# EAGLE design OpenAGBoardPart1 (EAGLE 7.5.0)
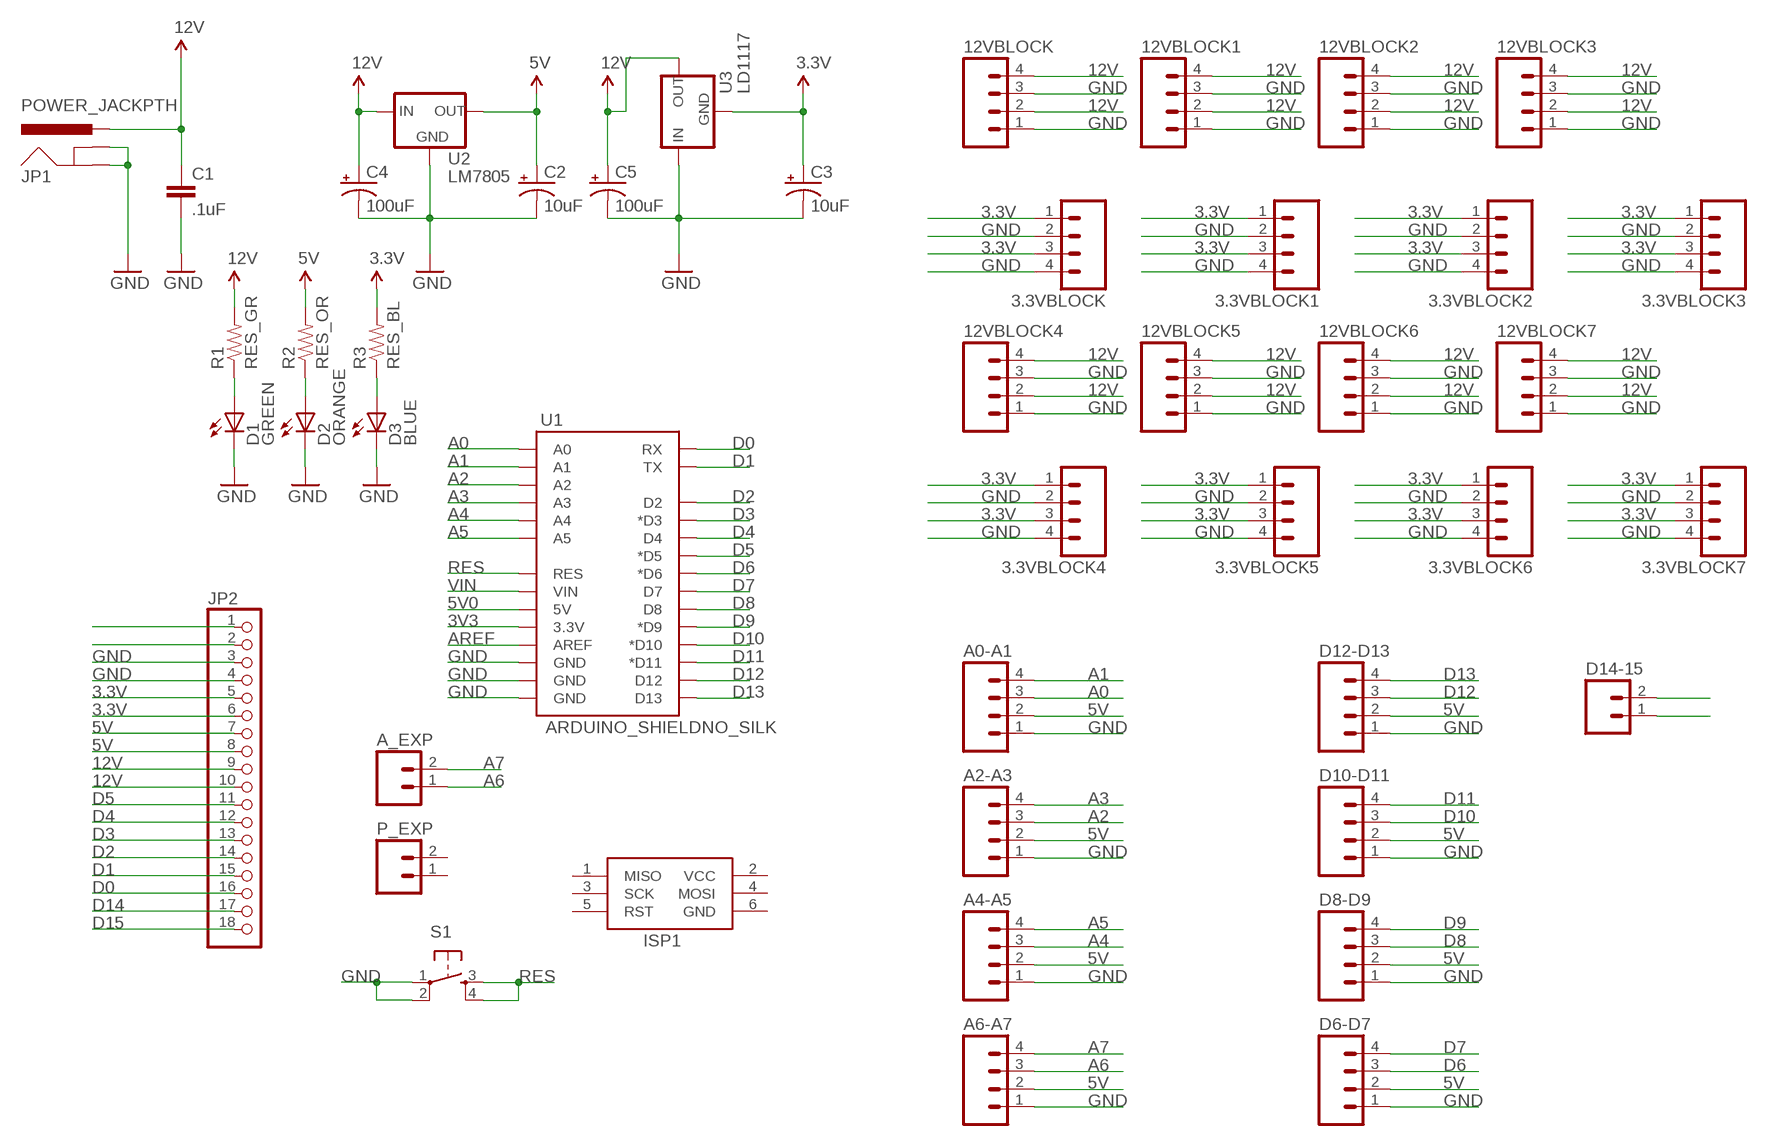
[diagram p0: schematic, sheet 1]

## Parts
3.3VBLOCK  M04NO_SILK_ALL_ROUND  [1X04_NO_SILK_ALL_ROUND]
3.3VBLOCK1  M04NO_SILK_ALL_ROUND  [1X04_NO_SILK_ALL_ROUND]
3.3VBLOCK2  M04NO_SILK_ALL_ROUND  [1X04_NO_SILK_ALL_ROUND]
3.3VBLOCK3  M04NO_SILK_ALL_ROUND  [1X04_NO_SILK_ALL_ROUND]
3.3VBLOCK4  M04NO_SILK_ALL_ROUND  [1X04_NO_SILK_ALL_ROUND]
3.3VBLOCK5  M04NO_SILK_ALL_ROUND  [1X04_NO_SILK_ALL_ROUND]
3.3VBLOCK6  M04NO_SILK_ALL_ROUND  [1X04_NO_SILK_ALL_ROUND]
3.3VBLOCK7  M04NO_SILK_ALL_ROUND  [1X04_NO_SILK_ALL_ROUND]
12VBLOCK  M04NO_SILK_ALL_ROUND  [1X04_NO_SILK_ALL_ROUND]
12VBLOCK1  M04NO_SILK_ALL_ROUND  [1X04_NO_SILK_ALL_ROUND]
12VBLOCK2  M04NO_SILK_ALL_ROUND  [1X04_NO_SILK_ALL_ROUND]
12VBLOCK3  M04NO_SILK_ALL_ROUND  [1X04_NO_SILK_ALL_ROUND]
12VBLOCK4  M04NO_SILK_ALL_ROUND  [1X04_NO_SILK_ALL_ROUND]
12VBLOCK5  M04NO_SILK_ALL_ROUND  [1X04_NO_SILK_ALL_ROUND]
12VBLOCK6  M04NO_SILK_ALL_ROUND  [1X04_NO_SILK_ALL_ROUND]
12VBLOCK7  M04NO_SILK_ALL_ROUND  [1X04_NO_SILK_ALL_ROUND]
A0-A1  M04NO_SILK_ALL_ROUND  [1X04_NO_SILK_ALL_ROUND]
A2-A3  M04NO_SILK_ALL_ROUND  [1X04_NO_SILK_ALL_ROUND]
A4-A5  M04NO_SILK_ALL_ROUND  [1X04_NO_SILK_ALL_ROUND]
A6-A7  M04NO_SILK_ALL_ROUND  [1X04_NO_SILK_ALL_ROUND]
A_EXP  M02PTH  [1X02]
C1  .1uF  CAPPTH  [CAP-PTH-SMALL]
C2  10uF  CAP_POLPTH2  [CPOL-RADIAL-10UF-25V]
C3  10uF  CAP_POLPTH2  [CPOL-RADIAL-10UF-25V]
C4  100uF  CAP_POLPTH1  [CPOL-RADIAL-100UF-25V]
C5  100uF  CAP_POLPTH1  [CPOL-RADIAL-100UF-25V]
D1  GREEN  LED5MM  [LED5MM]
D2  ORANGE  LED5MM  [LED5MM]
D3  BLUE  LED5MM  [LED5MM]
D6-D7  M04NO_SILK_ALL_ROUND  [1X04_NO_SILK_ALL_ROUND]
D8-D9  M04NO_SILK_ALL_ROUND  [1X04_NO_SILK_ALL_ROUND]
D10-D11  M04NO_SILK_ALL_ROUND  [1X04_NO_SILK_ALL_ROUND]
D12-D13  M04NO_SILK_ALL_ROUND  [1X04_NO_SILK_ALL_ROUND]
D14-15  M02PTH  [1X02]
ISP1  AVRISP-6  [AVRISP]
JP1  POWER_JACKPTH  [POWER_JACK_PTH]
JP2  PINHD-1X18-BIG  [1X18-BIG]
P_EXP  M02PTH  [1X02]
R1  RES_GR  RESISTORPTH-1/4W  [AXIAL-0.4]
R2  RES_OR  RESISTORPTH-1/4W  [AXIAL-0.4]
R3  RES_BL  RESISTORPTH-1/4W  [AXIAL-0.4]
S1  TAC_SWITCHPTH  [TACTILE-PTH]
U1  ARDUINO_SHIELDNO_SILK  [DUEMILANOVE_VIAS]
U2  LM7805  V_REG_78XXSINK  [TO220-IGO]
U3  LD1117  V_REG_78XXSINK  [TO220-IGO]

## Nets
3.3V: 3.3VBLOCK1.1 3.3VBLOCK1.3 3.3VBLOCK2.1 3.3VBLOCK2.3 3.3VBLOCK3.1 3.3VBLOCK3.3 3.3VBLOCK4.1 3.3VBLOCK4.3 3.3VBLOCK5.1 3.3VBLOCK5.3 3.3VBLOCK6.1 3.3VBLOCK6.3 3.3VBLOCK7.1 3.3VBLOCK7.3 3.3VBLOCK.1 3.3VBLOCK.3 C3.1(+) JP2.5 JP2.6 R3.P$2 U3.GND
3V3: U1.3.3V
5V: A0-A1.2 A2-A3.2 A4-A5.2 A6-A7.2 C2.1(+) D6-D7.2 D8-D9.2 D10-D11.2 D12-D13.2 JP2.7 JP2.8 R2.P$2 U2.OUT
5V0: U1.5V
12V: 12VBLOCK1.2 12VBLOCK1.4 12VBLOCK2.2 12VBLOCK2.4 12VBLOCK3.2 12VBLOCK3.4 12VBLOCK4.2 12VBLOCK4.4 12VBLOCK5.2 12VBLOCK5.4 12VBLOCK6.2 12VBLOCK6.4 12VBLOCK7.2 12VBLOCK7.4 12VBLOCK.2 12VBLOCK.4 C1.1 C4.1(+) C5.1(+) JP1.PWR JP2.9 JP2.10 R1.P$2 U2.IN U3.OUT
A0: A0-A1.3 U1.A0
A1: A0-A1.4 U1.A1
A2: A2-A3.3 U1.A2
A3: A2-A3.4 U1.A3
A4: A4-A5.3 U1.A4
A5: A4-A5.4 U1.A5
A6: A6-A7.3 A_EXP.1
A7: A6-A7.4 A_EXP.2
AREF: U1.AREF
CONTINUITY_STRIP: JP2.1
D0: JP2.16 U1.RX
D1: JP2.15 U1.TX
D2: JP2.14 U1.D2
D3: JP2.13 U1.D3(*D3)
D4: JP2.12 U1.D4
D5: JP2.11 U1.D5(*D5)
D6: D6-D7.3 U1.D6(*D6)
D7: D6-D7.4 U1.D7
D8: D8-D9.3 U1.D8
D9: D8-D9.4 U1.D9(*D9)
D10: D10-D11.3 U1.D10(*D10)
D11: D10-D11.4 U1.D11(*D11)
D12: D12-D13.3 U1.D12
D13: D12-D13.4 U1.D13
D14: D14-15.1 JP2.17
D15: D14-15.2 JP2.18
GND: 3.3VBLOCK1.2 3.3VBLOCK1.4 3.3VBLOCK2.2 3.3VBLOCK2.4 3.3VBLOCK3.2 3.3VBLOCK3.4 3.3VBLOCK4.2 3.3VBLOCK4.4 3.3VBLOCK5.2 3.3VBLOCK5.4 3.3VBLOCK6.2 3.3VBLOCK6.4 3.3VBLOCK7.2 3.3VBLOCK7.4 3.3VBLOCK.2 3.3VBLOCK.4 12VBLOCK1.1 12VBLOCK1.3 12VBLOCK2.1 12VBLOCK2.3 12VBLOCK3.1 12VBLOCK3.3 12VBLOCK4.1 12VBLOCK4.3 12VBLOCK5.1 12VBLOCK5.3 12VBLOCK6.1 12VBLOCK6.3 12VBLOCK7.1 12VBLOCK7.3 12VBLOCK.1 12VBLOCK.3 A0-A1.1 A2-A3.1 A4-A5.1 A6-A7.1 C1.2 C2.2(-) C3.2(-) C4.2(-) C5.2(-) D1.K(C) D2.K(C) D3.K(C) D6-D7.1 D8-D9.1 D10-D11.1 D12-D13.1 JP1.GND JP1.GNDBREAK JP2.3 JP2.4 S1.1 S1.2 U1.GND@0(GND) U1.GND@1(GND) U1.GND@2(GND) U2.GND U3.IN
N$1: D1.A R1.P$1
N$2: D2.A R2.P$1
N$3: D3.A R3.P$1
N$5: JP2.2
RES: S1.3 S1.4 U1.RES
VIN: U1.VIN
Unconnected: ISP1.1(MISO) ISP1.3(SCK) ISP1.4(MOSI) ISP1.5(RST) P_EXP.1 P_EXP.2

## Power pins joined to a net without a drawn wire
GND: ISP1.6(GND)
VCC: ISP1.2(VCC)

## Library data of the parts
3.3VBLOCK 3.3VBLOCK1-3.3VBLOCK7 12VBLOCK 12VBLOCK1-12VBLOCK7 A0-A1 A2-A3 A4-A5 A6-A7 D6-D7 D8-D9 D10-D11 D12-D13 = SparkFun-Connectors:M04: Header 4 Standard 4-pin 0.1" header. Use with straight break away headers (SKU : PRT-00116), right angle break away headers (PRT-00553), swiss pins (PRT-00743), machine pins (PRT-00117), and female headers (PRT-00115). Molex polarized connector foot print use with SKU : PRT-08231 with associated crimp pins and housings. 1MM SMD Version SKU: PRT-10208
A_EXP D14-15 P_EXP = SparkFun-Connectors:M02: Standard 2-pin 0.1" header. Use with - straight break away headers ( PRT-00116) - right angle break away headers (PRT-00553) - swiss pins (PRT-00743) - machine pins (PRT-00117) - female headers (PRT-00115) Molex polarized connector foot print use with: PRT-08233 with associated crimp pins and housings. 2.54_SCREWTERM for use with PRT-10571. 3.5mm Screw Terminal footprints for PRT-08084 5mm Screw Terminal footprints for use with PRT-08432
C1 = SparkFun-Capacitors:CAP: Capacitor Standard 0603 ceramic capacitor, and 0.1" leaded capacitor.
C2-C5 = SparkFun-Passives:CAP_POL: Capacitor Polarized These are standard SMD and PTH capacitors. Normally 10uF, 47uF, and 100uF in electrolytic and tantalum varieties. Always verify the external diameter of the through hole cap, it varies with capacity, voltage, and manufacturer. The EIA devices should be standard.
D1-D3 = adafruit:LED: LED OSRAM: - CHIPLED LG R971, LG N971, LY N971, LG Q971, LY Q971, LO R971, LY R971 LH N974, LH R974 LS Q976, LO Q976, LY Q976 LO Q996 - Hyper CHIPLED LW Q18S LB Q993, LB Q99A, LB R99A - SideLED LS A670, LO A670, LY A670, LG A670, LP A670 LB A673, LV A673, LT A673, LW A673 LH A674 LY A675 LS A676, LA A676, LO A676, LY A676, LW A676 LS A679, LY A679, LG A679 - Hyper Micro SIDELED® LS Y876, LA Y876, LO Y876, LY Y876 LT Y87S - SmartLED LW L88C, LW L88S LB L89C, LB L89S, LG L890 LS L89K, LO L89K, LY L89K LS L896, LA L896, LO L896, LY L896 - TOPLED LS T670, LO T670, LY T670, LG T670, LP T670 LSG T670, LSP T670, LSY T670, LOP T670, LYG T670 LG T671, LOG T671, LSG T671 LB T673, LV T673, LT T673, LW T673 LH T674 LS T676, LA T676, LO T676, LY T676, LB T676, LH T676, LSB T676, LW T676 LB T67C, LV T67C, LT T67C, LS T67K, LO T67K, LY T67K, LW E67C LS E67B, LA E67B, LO E67B, LY E67B, LB E67C, LV E67C, LT E67C LW T67C LS T679, LY T679, LG T679 LS T770, LO T770, LY T770, LG T770, LP T770 LB T773, LV T773, LT T773, LW T773 LH T774 LS E675, LA E675, LY E675, LS T675 LS T776, LA T776, LO T776, LY T776, LB T776 LHGB T686 LT T68C, LB T68C - Hyper Mini TOPLED® LB M676 - Mini TOPLED Santana® LG M470 LS M47K, LO M47K, LY M47K Source: http://www.osram.convergy.de/
ISP1 = adafruit:AVRISP: AVR ISP HEADER Standard 6 pin header for AVR programming
JP1 = SparkFun-Connectors:POWER_JACK: Power Jack This is the standard 5.5mm barrel jack for power. The PTH is the most common, proven, reliable, footprint. The Slot footprint only works if the mill layer is transmitted to the PCB fab house so be warned. Mating wall wart : TOL-00298 (and others); PROD_ID: CONN-08197
JP2 = adafruit:PINHD-1X18: PIN HEADER
R1-R3 = SparkFun-Passives:RESISTOR: Resistor Basic schematic elements and footprints for 0603, 1206, and PTH resistors.
S1 = SparkFun-Retired:TAC_SWITCH: Momentary Switch Button commonly used for reset or general input. Spark Fun Electronics SKU : COM-00097 SMT- SWCH-08247
U1 = SparkFun-Boards:ARDUINO_SHIELD: Arduino shield footprint
U2 U3 = SparkFun-PowerIC:V_REG_78XX: Voltage Regulator Standard 78xx regulator. IGO (Input Ground Output). Spark Fun Electronics SKU : COM-00107

## Board
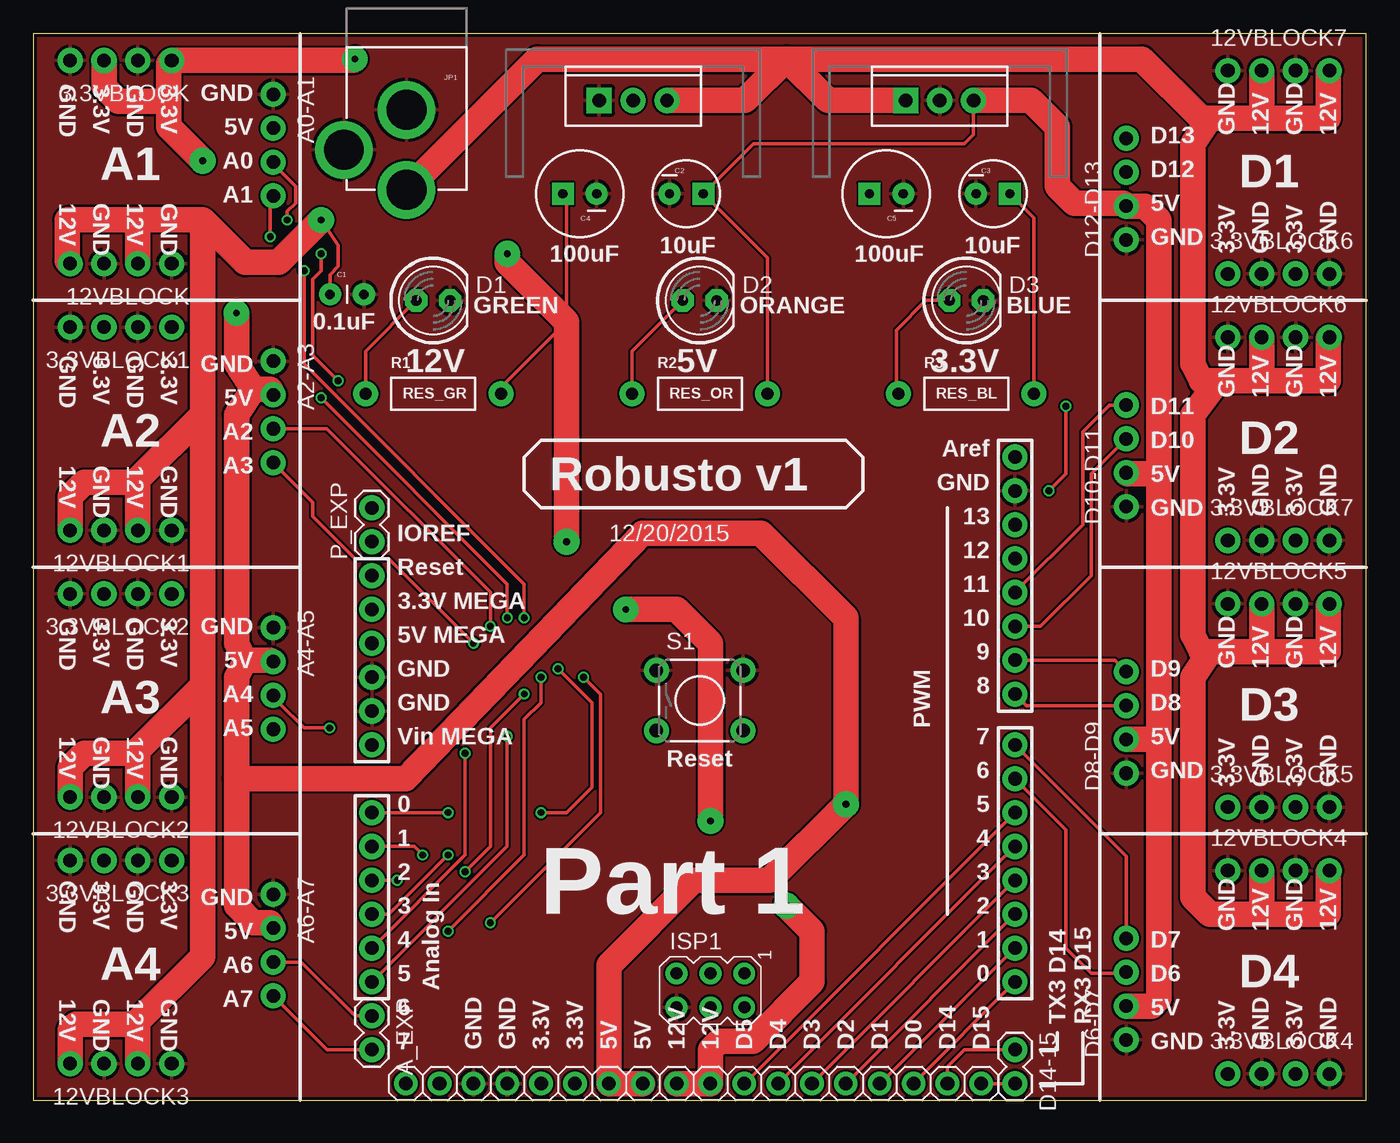
[diagram p1: board, top side]
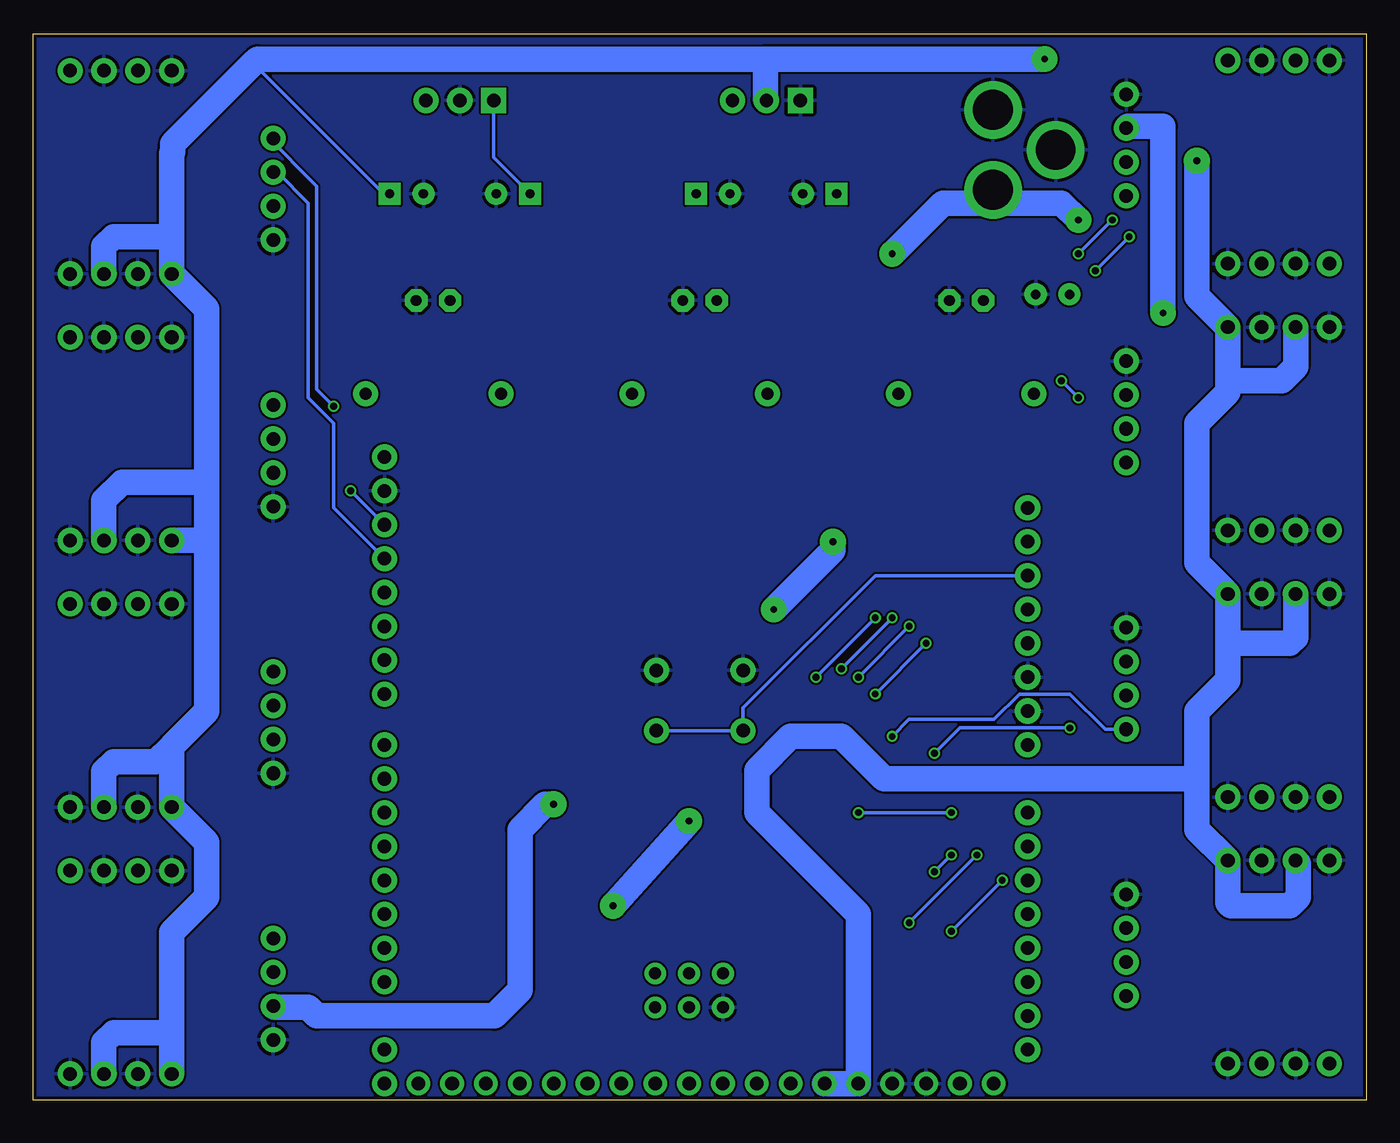
[diagram p2: board, bottom side, seen from below]

Size 100 x 80 mm. Coordinates in mm from the lower left corner, seen from the top.
Outline: 0,0 100,0 100,80 0,80 0,0
Copper layers (1*16): Top 0.035mm / dielectric 1.5mm / Bottom 0.035mm
Design rules "SeeedStudio_2layer_DRU_no_angle_20140221": minimum track width 6mil, minimum drill 12mil, track to track 6mil, track to pad 6mil, pad to pad 6mil, via to via 6mil, smd to smd 0mil, copper to edge 10mil, drill to drill 10mil, minimum pad ring 10mil, minimum via ring 6mil, stop-mask expansion 2mil, vias tented up to drill 100mil, thermal gap 10mil

### Footprints (pad centres in the part's own frame; a part is rotated, then mirrored left to right if it is on the bottom)
1X04_NO_SILK_ALL_ROUND = drill 1.016 pad 1.88: 1 0,0; 2 2.54,0; 3 5.08,0; 4 7.62,0
1X02 = drill 1.016 pad 1.88: 1 0,0; 2 2.54,0
CAP-PTH-SMALL = drill 0.7 pad 1.651: 1 0,0; 2 2.54,0
CPOL-RADIAL-10UF-25V = drill 0.7 pad 1.651 square: 1 1.27,0 | drill 0.7 pad 1.651: 2 -1.27,0
CPOL-RADIAL-100UF-25V = drill 0.7 pad 1.651 square: 1 1.27,0 | drill 0.7 pad 1.651: 2 -1.27,0
LED5MM = drill 0.813 pad 1.676 octagon: A -1.27,0; K 1.27,0
AVRISP = drill 0.9 pad 1.626: 1 -1.27,2.54; 2 1.27,2.54; 3 -1.27,0; 4 1.27,0; 5 -1.27,-2.54; 6 1.27,-2.54
POWER_JACK_PTH = drill 2.997 pad 4.318: GND 0,7.7; GNDBREAK 4.7,10.7; PWR 0,13.7
1X18-BIG = drill 1.016 pad 1.778: 1 -21.59,0; 2 -19.05,0; 3 -16.51,0; 4 -13.97,0; 5 -11.43,0; 6 -8.89,0; 7 -6.35,0; 8 -3.81,0; 9 -1.27,0; 10 1.27,0; 11 3.81,0; 12 6.35,0; 13 8.89,0; 14 11.43,0; 15 13.97,0; 16 16.51,0; 17 19.05,0; 18 21.59,0
AXIAL-0.4 = drill 0.9 pad 1.88: P$1 -5.08,0; P$2 5.08,0
TACTILE-PTH = drill 1.016 pad 1.88: 1 -3.251,2.261; 2 3.251,2.261; 3 -3.251,-2.261; 4 3.251,-2.261
DUEMILANOVE_VIAS = drill 1.016 pad 1.88: 3.3V 50.8,13.97; 5V 50.8,16.51; A0 50.8,29.21; A1 50.8,31.75; A2 50.8,34.29; A3 50.8,36.83; A4 50.8,39.37; A5 50.8,41.91; AREF 2.54,2.54; D2 2.54,36.83; D3 2.54,34.29; D4 2.54,31.75; D5 2.54,29.21; D6 2.54,26.67; D7 2.54,24.13; D8 2.54,20.32; D9 2.54,17.78; D10 2.54,15.24; D11 2.54,12.7; D12 2.54,10.16; D13 2.54,7.62; GND@0 50.8,19.05; GND@1 50.8,21.59; GND@2 2.54,5.08; RES 50.8,11.43; RX 2.54,41.91; TX 2.54,39.37; VIN 50.8,24.13
TO220-IGO = drill 1 pad 1.88: GND 0,0; OUT 2.54,0 | drill 1 pad 1.88 square: IN -2.54,0

### Placement (x,y rotation side)
3.3VBLOCK  10.38,78 180 top
3.3VBLOCK1  10.38,58 180 top
3.3VBLOCK2  10.38,38 180 top
3.3VBLOCK3  10.38,18 180 top
3.3VBLOCK4  89.62,2 0 top
3.3VBLOCK5  89.62,22 0 top
3.3VBLOCK6  89.62,62 0 top
3.3VBLOCK7  89.62,42 0 top
12VBLOCK  10.38,62.76 180 top
12VBLOCK1  10.38,42.76 180 top
12VBLOCK2  10.38,22.76 180 top
12VBLOCK3  10.38,2.76 180 top
12VBLOCK4  89.62,17.24 0 top
12VBLOCK5  89.62,37.24 0 top
12VBLOCK6  89.62,57.24 0 top
12VBLOCK7  89.62,77.24 0 top
A0-A1  18,75.46 270 top
A2-A3  18,55.46 270 top
A4-A5  18,35.46 270 top
A6-A7  18,15.46 270 top
A_EXP  25.4,6.35 270 top
C1  22.26,60.46 0 top
C2  49,68 0 top
C3  72,68 0 top
C4  41,68 180 top
C5  64,68 180 top
D1  30,60 0 top
D2  50,60 0 top
D3  70,60 0 top
D6-D7  82,4.54 90 top
D8-D9  82,24.54 90 top
D10-D11  82,44.54 90 top
D12-D13  82,64.54 90 top
D14-15  73.66,3.81 270 top
ISP1  50.8,8.26 270 top
JP1  28,82 180 top
JP2  49.53,1.27 0 top
P_EXP  25.4,41.91 90 top
R1  30,53 0 top
R2  50,53 0 top
R3  70,53 0 top
S1  50,30 0 top
U1  76.2,50.8 180 top
U2  68,75 0 top
U3  45,75 0 top

### Tracks (layer width: path | path; a pad name or v marks a point on that pad's centre or on a via)
3.3V  (via drill 0.51 pad 1.93)
  Top 0.254: R3.P$2 75.08,66.19 C3.1
  Top 1.93: 3.3VBLOCK.3 5.3,75.98 6.35,74.93 10.16,74.93 | 10.16,74.93 10.16,77.78 3.3VBLOCK.1 24.02,78 v24.13,78.11 | 10.16,74.93 10.16,73.03 v12.7,70.48
  Bottom 0.254: C3.1 73.72,68 83.5,77.79
  Bottom 1.93: v24.13,78.11 45.09,78.11 | 45.09,78.11 45.09,75.08 U3.GND | 89.62,64.77 3.3VBLOCK6.1 87,59.38 87,46.35 | 89.62,64.77 89.62,71.03 89.53,71.12 89.53,71.75 83.5,77.79 83.19,78.11 45.09,78.11 | 3.3VBLOCK6.3 94.7,64.05 93.98,64.77 89.62,64.77 | 3.3VBLOCK4.1 89.62,5.08 | 89.62,5.08 89.62,12.62 87,15.24 87,19.38 3.3VBLOCK5.1 89.62,26.59 | 3.3VBLOCK4.3 94.7,4.36 93.98,5.08 89.62,5.08 | 3.3VBLOCK7.1 87.08,42 87,41.91 | 87,41.91 87,46.35 | 3.3VBLOCK7.3 94.7,45 93.34,46.35 87,46.35 | 89.62,26.59 87,29.21 87,41.91 | 3.3VBLOCK5.3 94.7,24.68 93.98,25.4 90.81,25.4 89.62,26.59 | v12.7,70.48 12.7,60.32 3.3VBLOCK1.1 10.38,53.98 | 10.38,53.98 10.38,53.12 12.7,50.8 12.7,40.32 3.3VBLOCK2.1 10.38,34.29 | 10.38,34.29 10.38,31.53 12.7,29.21 12.7,24.13 | 12.7,24.13 12.7,20.32 3.3VBLOCK3.1 10.38,14.82 10.16,14.61 5.71,14.61 5.08,15.24 5.08,17.78 3.3VBLOCK3.3 | 3.3VBLOCK1.3 5.3,55.02 6.35,53.98 10.38,53.98 | 3.3VBLOCK2.3 5.3,34.7 5.71,34.29 10.38,34.29 | JP2.6 JP2.5 38.1,13.97 45.72,21.59 45.72,24.77 43.18,27.3 39.37,27.3 36.2,24.13 12.7,24.13
5V  (via drill 0.51 pad 1.93)
  Top 0.254: R2.P$2 55.08,63.19 C2.1 54.02,71.75 69.85,71.75 70.54,72.44 U2.OUT
  Top 1.93: 84.45,46.99 84.45,66.04 83.42,67.08 D12-D13.2 81.77,67.31 78.11,67.31 76.83,68.58 76.83,73.03 74.86,75 U2.OUT | 84.45,46.99 82.09,46.99 D10-D11.2 | D8-D9.2 84.23,27.08 | 84.23,27.08 84.45,27.3 84.45,46.99 | D6-D7.2 83.92,7.08 84.45,7.62 84.45,26.86 84.23,27.08 | 16.51,53.34 17.78,53.34 A2-A3.2 | 16.51,53.34 15.24,55.24 v15.24,59.05 | 15.88,33.02 15.24,34.29 15.24,51.44 16.51,53.34 | 15.88,33.02 17.78,33.02 A4-A5.2 | 15.24,24.13 15.24,31.75 15.88,33.02 | 15.24,24.13 15.24,14.61 16.51,13.34 17.78,13.34 A6-A7.2 | 15.24,24.13 27.94,24.13 45.72,42.55 54.61,42.55 60.96,36.2 v60.96,22.23 55.24,16.51 49.53,16.51 43.18,10.16 JP2.7 JP2.8
  Bottom 1.93: v15.24,59.05 15.24,73.05 17.87,73.05 A0-A1.2 | v60.96,22.23 61.59,22.23 63.5,20.32 63.5,8.26 65.41,6.35 78.74,6.35 79.38,6.99 81.91,6.99 D6-D7.2
12V  (via drill 0.51 pad 1.93)
  Top 0.254: R1.P$2 35.08,53.49 40.01,58.42 40.01,67.72 C4.1 | C1.1 22.26,61.92 22.87,62.56 22.86,63.18 22.86,64.14 v21.59,66.04
  Top 1.93: 56.52,78.11 37.8,78.11 JP1.PWR | 56.52,78.11 83.19,78.11 87.63,73.66 88.27,73.66 | 92.08,73.66 97.16,73.66 97.16,77.16 12VBLOCK7.4 | 12VBLOCK7.2 92.16,73.75 92.08,73.66 | 92.08,73.66 88.27,73.66 | 88.27,73.66 87,71.75 87,55.24 87.63,53.98 88.9,53.98 | 92.08,53.98 97.16,53.98 97.16,57.16 12VBLOCK6.4 | 12VBLOCK6.2 92.16,54.06 92.08,53.98 | 92.08,53.98 88.9,53.98 | 88.9,53.98 87,51.44 87,34.92 87.63,33.66 88.27,33.66 | 92.08,33.66 97.16,33.66 97.16,37.16 12VBLOCK5.4 | 12VBLOCK5.2 92.16,33.74 92.08,33.66 | 92.08,33.66 88.27,33.66 | 88.27,33.66 87,31.75 87,15.24 88.27,13.97 92.08,13.97 | 92.08,13.97 97.16,13.97 97.16,17.16 12VBLOCK4.4 | 12VBLOCK4.2 92.16,14.05 92.08,13.97 | v21.59,66.04 18.41,62.87 15.88,62.87 12.7,66.04 | 12.7,66.04 8.26,66.04 | 8.26,66.04 2.54,66.04 2.54,62.98 12VBLOCK.4 | 12VBLOCK.2 7.84,65.62 8.26,66.04 | 12VBLOCK1.2 7.84,46.58 | 7.84,46.58 12.7,51.44 | 12.7,51.44 12.7,66.04 | 12VBLOCK1.4 2.76,45.3 3.81,46.35 7.62,46.35 7.84,46.58 | 12VBLOCK2.2 7.84,26.04 | 7.84,26.04 7.84,26.25 12.7,31.11 | 12.7,31.11 12.7,51.44 | 12VBLOCK2.4 2.76,24.98 3.81,26.04 7.84,26.04 | 12VBLOCK3.2 7.84,5.71 | 7.84,5.71 7.84,5.93 12.7,10.79 12.7,31.11 | 12VBLOCK3.4 2.76,5.3 3.17,5.71 7.84,5.71 | v40.01,41.91 40.01,58.42 35.56,62.87 v35.56,63.5 | JP2.9 JP2.10 50.8,3.81 51.44,4.45 53.98,4.45 58.42,8.89 58.42,12.7 v56.52,14.61 | U3.OUT 53.41,75 56.52,78.11 | U2.IN 59.62,75 56.52,78.11 | v44.45,36.83 48.26,36.83 50.8,34.29 v50.8,20.95
  Bottom 0.254: U2.IN 65.46,70.73 C5.1
  Bottom 1.93: v44.45,36.83 40.01,41.27 v40.01,41.91 | v21.59,66.04 22.86,67.31 28.99,67.31 | v35.56,63.5 31.75,67.31 28.99,67.31 | v56.52,14.61 v50.8,20.95 | 28.99,67.31 JP1.PWR
A0  (via drill 0.51 pad 0.25)
  Top 0.254: v38.1,21.59 40.01,21.59 41.91,23.5 41.91,29.84 v39.37,32.38 | U1.A0 v31.11,21.59 | v35.56,36.2 35.56,38.73 v21.59,52.7 | v22.86,53.98 20.95,55.88 20.95,61.59 21.59,62.23 v21.59,63.5 | v19.05,66.04 19.05,66.67 19.68,67.31 19.68,68.58 18.41,69.85 A0-A1.3
  Bottom 0.254: v31.11,21.59 v38.1,21.59 | v35.56,36.2 v39.37,32.38 | v22.86,53.98 v21.59,52.7 | v19.05,66.04 v21.59,63.5
A1  (via drill 0.51 pad 0.25)
  Top 0.254: v41.27,31.75 42.55,30.48 42.55,21.59 v34.29,13.34 | v36.83,36.2 36.83,38.73 20.32,55.24 v20.32,62.23 | v17.78,64.77 17.78,67.31 A0-A1.4 | v29.21,18.41 28.57,19.05 U1.A1
  Bottom 0.254: v36.83,36.2 v41.27,31.75 | v17.78,64.77 v20.32,62.23 | v29.21,18.41 v34.29,13.34
A2  (via drill 0.51 pad 0.25)
  Top 0.254: v27.3,16.51 U1.A2 | v31.11,12.7 36.83,18.41 36.83,28.57 38.1,29.84 v38.1,31.75 | A2-A3.3 22.01,50.38 34.29,38.1 v34.29,35.56
  Bottom 0.254: v31.11,12.7 v27.3,16.51 | v34.29,35.56 v38.1,31.75
A3  (via drill 0.51 pad 0.25)
  Top 0.254: v33.02,34.29 26.67,40.64 24.13,40.64 20.95,43.81 20.95,44.88 A2-A3.4 | v36.83,30.48 34.29,27.94 34.29,19.05 v32.38,17.14 | v31.11,18.41 26.67,13.97 U1.A3
  Bottom 0.254: v36.83,30.48 v33.02,34.29 | v31.11,18.41 v32.38,17.14
A4  (via drill 0.51 pad 0.25)
  Top 0.254: v32.38,26.04 32.38,18.41 U1.A4 | A4-A5.3 18.41,29.84 20.32,27.94 v22.23,27.94
  Bottom 0.254: v22.23,27.94 30.48,27.94 v32.38,26.04
A5  (via drill 0.51 pad 0.25)
  Top 0.254: U1.A5 35.56,19.05 v35.56,27.3
  Bottom 0.254: v35.56,27.3 34.29,28.57 27.94,28.57 26.04,30.48 22.23,30.48 19.59,27.84 A4-A5.4
A6
  Top 0.254: A6-A7.3 20.1,10.38 24.13,6.35 A_EXP.1
A7
  Top 0.254: A_EXP.2 22.03,3.81 A6-A7.4
D0
  Top 0.254: U1.RX JP2.16
D1
  Top 0.254: U1.TX JP2.15
D2
  Top 0.254: JP2.14 U1.D2
D3
  Top 0.254: U1.D3 JP2.13
D4
  Top 0.254: JP2.12 U1.D4
D5
  Top 0.254: U1.D5 JP2.11
D6
  Top 0.254: U1.D6 77.47,20.32 77.47,11.43 79.38,9.53 81.91,9.53 D6-D7.3
D7
  Top 0.254: D6-D7.4 82,18.33 U1.D7
D8
  Top 0.254: D8-D9.3 74.52,29.62 U1.D8
D9
  Top 0.254: U1.D9 81.14,33.02 D8-D9.4
D10
  Top 0.254: U1.D10 75.56,35.56 79.38,39.37 79.38,46.99 D10-D11.3
D11
  Top 0.254: D10-D11.4 80.73,52.16 78.74,50.16 78.74,43.18 U1.D11
D12
  Bottom 0.254: D12-D13.3 81.69,69.62 79.38,67.31 79.38,52.7 77.47,50.8 77.47,44.45 U1.D12
D13  (via drill 0.51 pad 0.25)
  Top 0.254: v76.2,45.72 77.47,46.99 v77.47,52.07
  Bottom 0.254: v76.2,45.72 U1.D13 | v77.47,52.07 78.74,53.34 78.74,68.58 82.55,72.39 D12-D13.4
D14
  Top 0.254: JP2.17 68.58,2.54 69.85,3.81 D14-15.1
D15
  Top 0.254: D14-15.2 JP2.18
GND
  pour Top: 0,0 100,0 100,80 0,80
  pour Bottom: 0,0 100,0 100,80 0,80
N$1
  Top 0.254: R1.P$1 24.92,56.19 D1.A
N$2
  Top 0.254: R2.P$1 44.92,56.19 D2.A
N$3
  Top 0.254: D3.A 66.98,60 64.77,57.78 64.77,53.15 R3.P$1
RES
  Bottom 0.254: S1.4 S1.3 46.75,29.45 36.83,39.37 U1.RES

### Text on the board
tPlace: GND | 3.3V | GND | 3.3V | GND | 5V | D13 | GND | 12V | GND | 12V | A0 | D1 | A1 | A1 | D12 | 12V | GND | 12V | GND | 5V | 10uF | 10uF | GND | 3.3V | GND | 3.3V | GND | 100uF | 100uF | GREEN | ORANGE | BLUE | 0.1uF | GND | 3.3V | GND | 3.3V | GND | 12V | 5V | 3.3V | 5V | GND | 12V | GND | 12V | A2 | D11 | D2 | Aref | A2 | D10 | 12V | GND | 12V | GND | A3 | GND | Robusto v1 | 5V | 13 | GND | 3.3V | GND | 3.3V | GND | IOREF | 12/20/2015 | 12 | Reset | 11 | 3.3V MEGA | 10 | GND | 3.3V | GND | 3.3V | GND | 5V | 5V MEGA | 9 | GND | 8 | D9 | GND | 12V | GND | 12V | A4 | D3 | A3 | A5 | GND | D8 | PWM | 7 | 12V | GND | 12V | GND | Vin MEGA | 5V | Reset | 6 | GND | 5 | 3.3V | GND | 3.3V | GND | 0 | 4 | 1 | 3 | GND | 3.3V | GND | 3.3V | 2 | GND | 2 | 3 | Part 1 | 5V | 1 | GND | 12V | GND | 12V | A6 | 4 | D7 | D4 | 0 | A4 | 5 | D6 | 12V | GND | 12V | GND | A7 | Analog In | 6 | TX3 D14 | RX3 D15 | 5V | 7 | GND | GND | 3.3V | 3.3V | 5V | 5V | 12V | 12V | D5 | D4 | D3 | D2 | D1 | D0 | D14 | D15 | GND | 3.3V | GND | 3.3V | GND